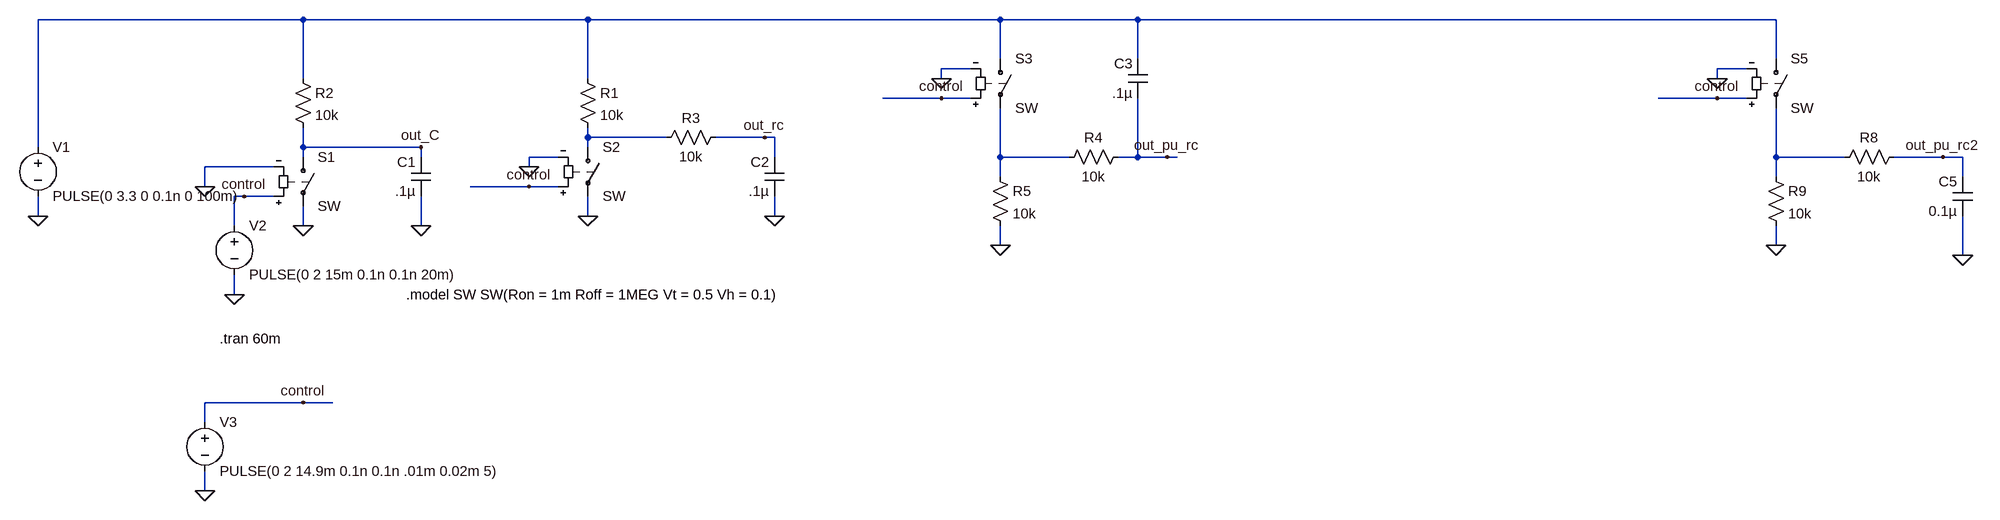
[diagram p0: schematic switch.asc]
switch.asc, the LTspice schematic file:
Version 4
SHEET 1 3164 848
WIRE 416 64 -16 64
WIRE 880 64 416 64
WIRE 1552 64 880 64
WIRE 1776 64 1552 64
WIRE 2816 64 1776 64
WIRE 1552 128 1552 64
WIRE 1776 128 1776 64
WIRE 2816 128 2816 64
WIRE 1504 144 1456 144
WIRE 2768 144 2720 144
WIRE 416 160 416 64
WIRE 880 160 880 64
WIRE 1456 160 1456 144
WIRE 2720 160 2720 144
WIRE 1456 192 1360 192
WIRE 1504 192 1456 192
WIRE 2720 192 2624 192
WIRE 2768 192 2720 192
WIRE 880 256 880 240
WIRE 1008 256 880 256
WIRE 1168 256 1088 256
WIRE 1184 256 1168 256
WIRE -16 272 -16 64
WIRE 416 272 416 240
WIRE 608 272 416 272
WIRE 880 272 880 256
WIRE 416 288 416 272
WIRE 608 288 608 272
WIRE 832 288 784 288
WIRE 1184 288 1184 256
WIRE 1552 288 1552 208
WIRE 1664 288 1552 288
WIRE 1776 288 1776 192
WIRE 1776 288 1744 288
WIRE 1824 288 1776 288
WIRE 1840 288 1824 288
WIRE 2816 288 2816 208
WIRE 2928 288 2816 288
WIRE 3088 288 3008 288
WIRE 3120 288 3088 288
WIRE 368 304 256 304
WIRE 784 304 784 288
WIRE 1552 320 1552 288
WIRE 2816 320 2816 288
WIRE 3120 320 3120 288
WIRE 256 336 256 304
WIRE 784 336 688 336
WIRE 832 336 784 336
WIRE 320 352 304 352
WIRE 368 352 320 352
WIRE -16 384 -16 352
WIRE 880 384 880 352
WIRE 1184 384 1184 352
WIRE 304 400 304 352
WIRE 416 400 416 368
WIRE 608 400 608 352
WIRE 1552 432 1552 400
WIRE 2816 432 2816 400
WIRE 3120 448 3120 384
WIRE 304 512 304 480
WIRE 416 688 256 688
WIRE 464 688 416 688
WIRE 256 720 256 688
WIRE 256 832 256 800
FLAG 304 512 0
FLAG 256 336 0
FLAG -16 384 0
FLAG 608 400 0
FLAG 416 400 0
FLAG 608 272 out_C
FLAG 880 384 0
FLAG 1184 384 0
FLAG 784 304 0
FLAG 320 352 control
FLAG 784 336 control
FLAG 256 832 0
FLAG 416 688 control
FLAG 1456 160 0
FLAG 1456 192 control
FLAG 1552 432 0
FLAG 1168 256 out_rc
FLAG 1824 288 out_pu_rc
FLAG 2720 160 0
FLAG 2720 192 control
FLAG 2816 432 0
FLAG 3088 288 out_pu_rc2
FLAG 3120 448 0
SYMBOL voltage -16 256 R0
SYMATTR InstName V1
SYMATTR Value PULSE(0 3.3 0 0.1n 0 100m)
SYMBOL sw 416 272 R0
SYMATTR InstName S1
SYMBOL voltage 304 384 R0
SYMATTR InstName V2
SYMATTR Value PULSE(0 2 15m 0.1n 0.1n 20m)
SYMATTR SpiceLine Rser=10
SYMBOL res 400 144 R0
SYMATTR InstName R2
SYMATTR Value 10k
SYMBOL Cap 624 352 R180
WINDOW 0 24 56 Left 2
WINDOW 3 24 8 Left 2
SYMATTR InstName C1
SYMATTR Value .1µ
SYMBOL res 864 144 R0
SYMATTR InstName R1
SYMATTR Value 10k
SYMBOL sw 880 256 R0
SYMATTR InstName S2
SYMBOL res 992 272 R270
WINDOW 0 32 56 VTop 2
WINDOW 3 0 56 VBottom 2
SYMATTR InstName R3
SYMATTR Value 10k
SYMBOL Cap 1200 352 R180
WINDOW 0 24 56 Left 2
WINDOW 3 24 8 Left 2
SYMATTR InstName C2
SYMATTR Value .1µ
SYMBOL voltage 256 704 R0
SYMATTR InstName V3
SYMATTR Value PULSE(0 2 14.9m 0.1n 0.1n .01m 0.02m 5)
SYMATTR SpiceLine Rser=10
SYMBOL sw 1552 112 R0
SYMATTR InstName S3
SYMBOL Cap 1792 192 R180
WINDOW 0 24 56 Left 2
WINDOW 3 24 8 Left 2
SYMATTR InstName C3
SYMATTR Value .1µ
SYMBOL res 1648 304 R270
WINDOW 0 32 56 VTop 2
WINDOW 3 0 56 VBottom 2
SYMATTR InstName R4
SYMATTR Value 10k
SYMBOL res 1536 304 R0
SYMATTR InstName R5
SYMATTR Value 10k
SYMBOL sw 2816 112 R0
SYMATTR InstName S5
SYMBOL Cap 3136 384 R180
WINDOW 0 24 56 Left 2
WINDOW 3 24 8 Left 2
SYMATTR InstName C5
SYMATTR Value 0.1µ
SYMBOL res 2912 304 R270
WINDOW 0 32 56 VTop 2
WINDOW 3 0 56 VBottom 2
SYMATTR InstName R8
SYMATTR Value 10k
SYMBOL res 2800 304 R0
SYMATTR InstName R9
SYMATTR Value 10k
TEXT 584 512 Left 2 !.model SW SW(Ron = 1m Roff = 1MEG Vt = 0.5 Vh = 0.1)
TEXT 280 584 Left 2 !.tran 60m

The netlist it stands for:
* switch.asc
V1 N001 0 PULSE(0 3.3 0 0.1n 0 100m)
S1 out_C 0 control 0 SW
V2 control 0 PULSE(0 2 15m 0.1n 0.1n 20m) Rser=10
R2 N001 out_C 10k
C1 0 out_C .1µ
R1 N001 N002 10k
S2 N002 0 control 0 SW
R3 N002 out_rc 10k
C2 0 out_rc .1µ
V3 control 0 PULSE(0 2 14.9m 0.1n 0.1n .01m 0.02m 5) Rser=10
S3 N001 N003 control 0 SW
C3 out_pu_rc N001 .1µ
R4 N003 out_pu_rc 10k
R5 N003 0 10k
S5 N001 N004 control 0 SW
C5 0 out_pu_rc2 0.1µ
R8 N004 out_pu_rc2 10k
R9 N004 0 10k
.model SW SW(Ron = 1m Roff = 1MEG Vt = 0.5 Vh = 0.1)
.tran 60m
.backanno
.end